# Altium schematic sheet IR2104(7).SchDoc
size A4
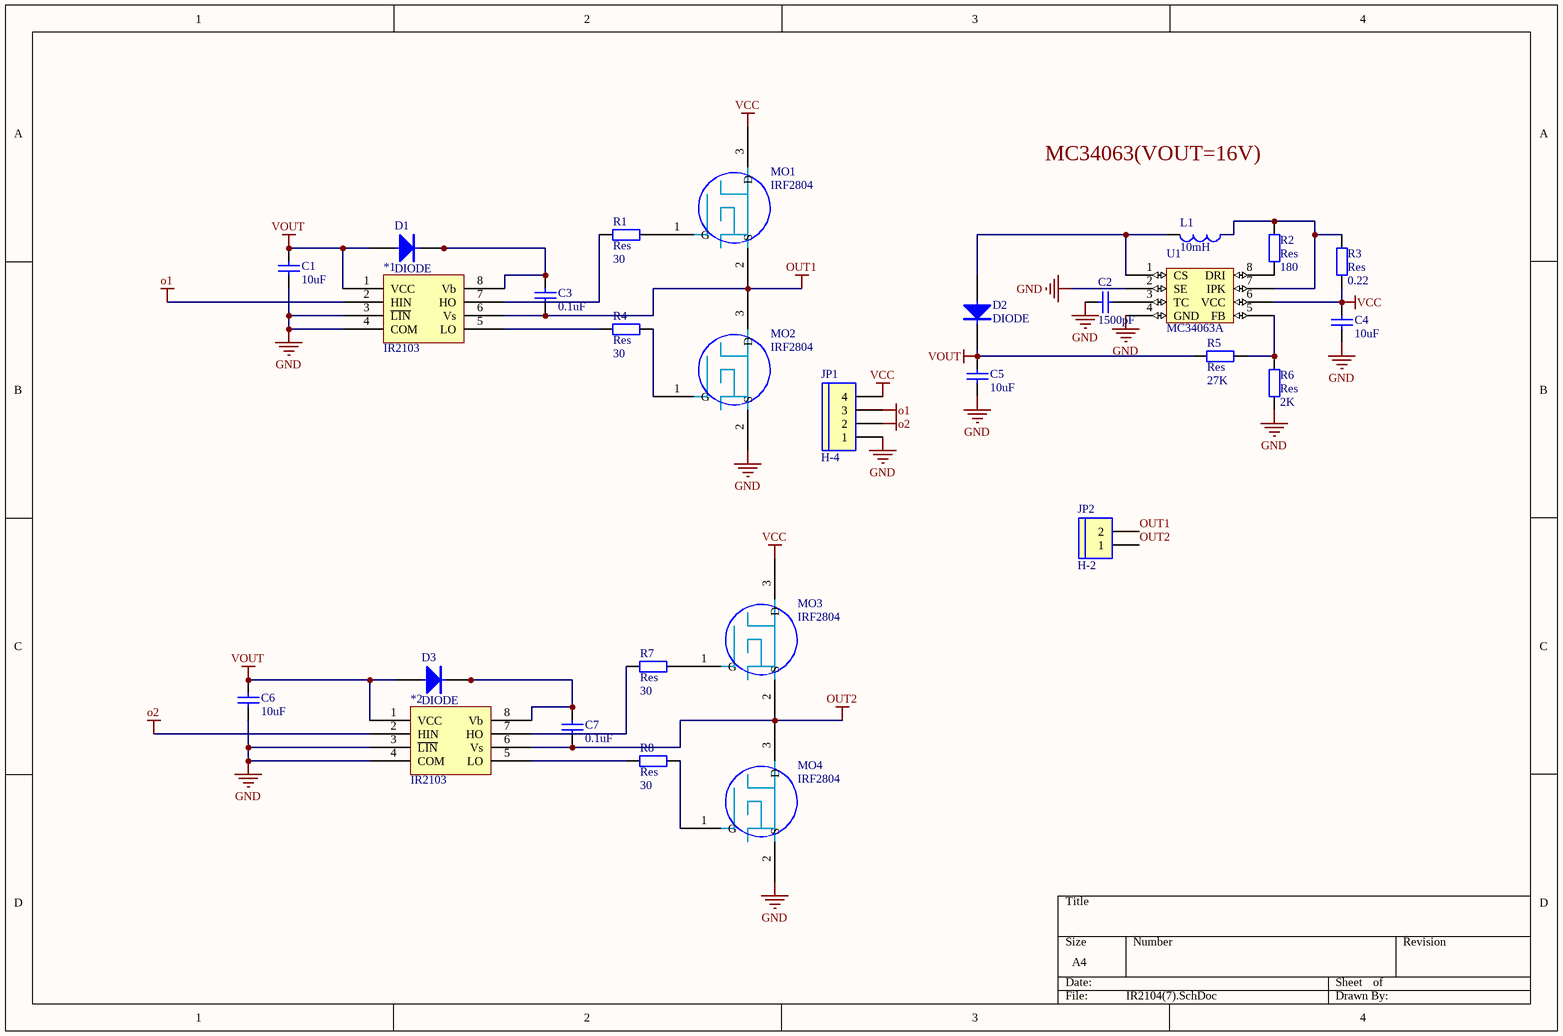
[diagram p0: IR2104(7).SchDoc]

## Parts
*1  IR2103  [IR2104S]
*2  IR2103  [IR2104S]
C1  value 10uF  [CC1005-0402]  (hidden comment: CAP_1)
C2  value 1500pF  [CC1005-0402]  (hidden comment: CAP_1)
C3  value 0.1uF  [CC1005-0402]  (hidden comment: CAP_1)
C4  value 10uF  [CC1005-0402]  (hidden comment: CAP_1)
C5  value 10uF  [CC1005-0402]  (hidden comment: CAP_1)
C6  value 10uF  [CC1005-0402]  (hidden comment: CAP_1)
C7  value 0.1uF  [CC1005-0402]  (hidden comment: CAP_1)
D1  DIODE  [diode stan]
D2  DIODE  [diode stan]
D3  DIODE  [diode stan]
JP1  H-4  [H-4/4 -T]
JP2  H-2  [H-2/2-T]
L1  10mH  [贴片电感]
MO1  IRF2804  [TS-005]
MO2  IRF2804  [TS-005]
MO3  IRF2804  [TS-005]
MO4  IRF2804  [TS-005]
R1  Res  value 30  [R2012-0805]
R2  Res  value 180  [R2012-0805]
R3  Res  value 0.22  [R2012-0805]
R4  Res  value 30  [R2012-0805]
R5  Res  value 27K  [R2012-0805]
R6  Res  value 2K  [R2012-0805]
R7  Res  value 30  [R2012-0805]
R8  Res  value 30  [R2012-0805]
U1  MC34063A  [SOP-8]

## Nets
GND: *1.3(~{LIN}) *1.4(COM) *2.3(~{LIN}) *2.4(COM) C1.1 C2.1 C4.1 C5.1 C6.1 JP1.1 MO2.2(S) MO4.2(S) R6.1 U1.2(SE) U1.4(GND)
o1: *1.2(HIN) JP1.3
o2: *2.2(HIN) JP1.2
OUT1: *1.6(Vs) C3.1 JP2.2 MO1.2(S) MO2.3(D)
OUT2: *2.6(Vs) C7.1 JP2.1 MO3.2(S) MO4.3(D)
VCC: C4.2 JP1.4 MO1.3(D) MO3.3(D) R3.2 U1.6(VCC)
VOUT: *1.1(VCC) *2.1(VCC) C1.2 C5.2 C6.2 D1.1(A) D2.2(K) D3.1(A) R5.1
Net*1_5: *1.5(LO) R4.1
Net*1_7: *1.7(HO) R1.1
Net*1_8: *1.8(Vb) C3.2 D1.2(K)
Net*2_5: *2.5(LO) R8.1
Net*2_7: *2.7(HO) R7.1
Net*2_8: *2.8(Vb) C7.2 D3.2(K)
NetC2_2: C2.2 U1.3(TC)
NetD2_1: D2.1(A) L1.1 U1.1(CS)
NetL1_2: L1.2 R2.2 R3.1 U1.7(IPK)
NetMO1_1: MO1.1(G) R1.2
NetMO2_1: MO2.1(G) R4.2
NetMO3_1: MO3.1(G) R7.2
NetMO4_1: MO4.1(G) R8.2
NetR2_1: R2.1 U1.8(DRI)
NetR5_2: R5.2 R6.2 U1.5(FB)

## Notes on the sheet
- Labels drawn without touching a wire or pin: MC34063(VOUT=16V)

## Library data of the parts
C1-C7 = CAP_1: Capacitor; Manufacturer: Generic Components; Class: Passive; Published: 08/06/2000; Publisher: Altium Hobart Technology Centre; SubClass: Capacitor
JP1 = H-4: Header, 4-Pin; Manufacturer: Generic Components; Class: Connector
JP2 = H-2: Header, 2-Pin; Manufacturer: Generic Components; Class: Connector
L1 = INDUCTOR
R1-R8 = Res: Resistor; Manufacturer: Generic Components; Class: Passive; Published: 08/06/2000; Publisher: Altium Hobart Technology Centre; SubClass: Resistor